# Altium schematic sheet Feedback.SchDoc
size 420 x 297 mm; DocumentNumber: 5; SheetNumber: 13; SheetTotal: 14; PageSetup: Record=PageOptions|CenterHorizontal=True|CenterVertical=True|PrintScale=0.96|XCorrection=1.00|YCorrection=1.00|PrintKind=1|BorderSize=5000000|LeftOffset=0|BottomOffset=0|Orientation=2|PaperLength=4318|PaperWidth=2794|Scale=100|PaperSource=7|PrintQuality=600|MediaType=1|DitherType=10|PaperKind=11" x 17"|PrintScaleMode=1
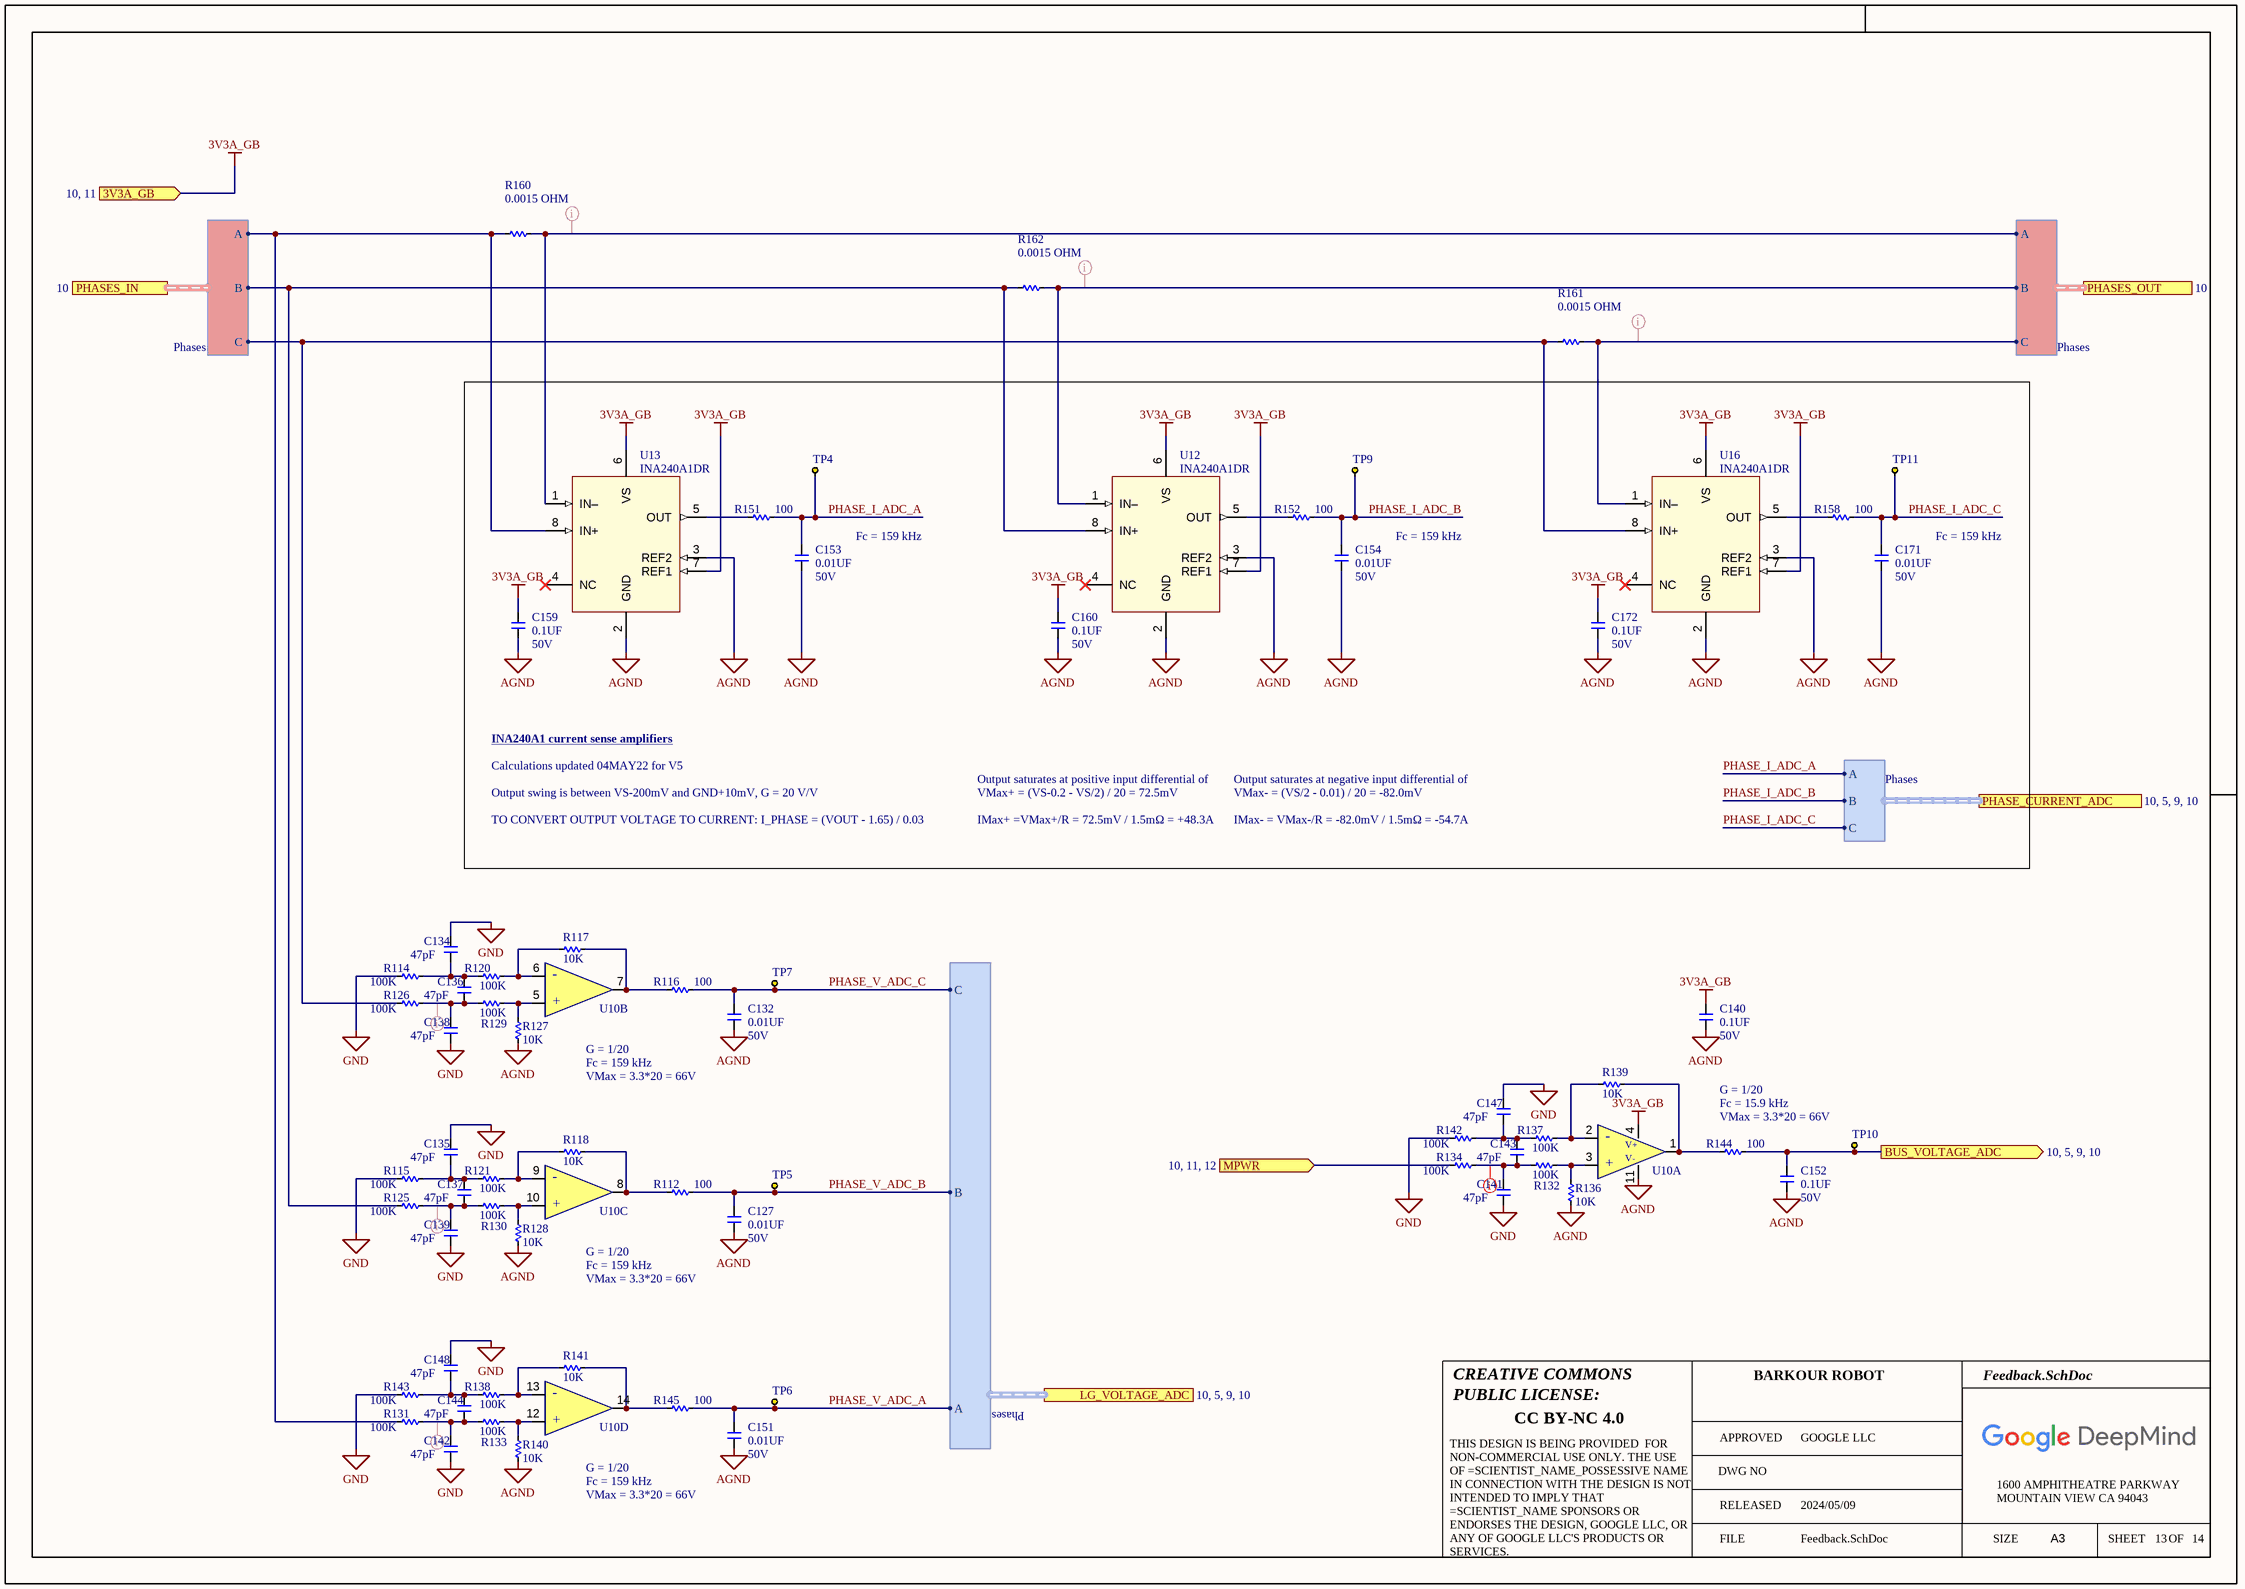
[diagram p0: Feedback.SchDoc]

## Parts
C127  value 0.01UF  Voltage: 50V  [C0402]  (hidden comment: __Template_Cap)
C132  value 0.01UF  Voltage: 50V  [C0402]  (hidden comment: __Template_Cap)
C134  value 47pF  [C0402]  (hidden comment: __Template_Cap)
C135  value 47pF  [C0402]  (hidden comment: __Template_Cap)
C136  value 47pF  [C0402]  (hidden comment: __Template_Cap)
C137  value 47pF  [C0402]  (hidden comment: __Template_Cap)
C138  value 47pF  [C0402]  (hidden comment: __Template_Cap)
C139  value 47pF  [C0402]  (hidden comment: __Template_Cap)
C140  value 0.1UF  Voltage: 50V  [C0402]  (hidden comment: __Template_Cap)
C141  value 47pF  [C0402]  (hidden comment: __Template_Cap)
C142  value 47pF  [C0402]  (hidden comment: __Template_Cap)
C143  value 47pF  [C0402]  (hidden comment: __Template_Cap)
C144  value 47pF  [C0402]  (hidden comment: __Template_Cap)
C147  value 47pF  [C0402]  (hidden comment: __Template_Cap)
C148  value 47pF  [C0402]  (hidden comment: __Template_Cap)
C151  value 0.01UF  Voltage: 50V  [C0402]  (hidden comment: __Template_Cap)
C152  value 0.1UF  Voltage: 50V  [C0402]  (hidden comment: __Template_Cap)
C153  value 0.01UF  Voltage: 50V  [C0402]  (hidden comment: __Template_Cap)
C154  value 0.01UF  Voltage: 50V  [C0402]  (hidden comment: __Template_Cap)
C159  value 0.1UF  Voltage: 50V  [C0402]  (hidden comment: __Template_Cap)
C160  value 0.1UF  Voltage: 50V  [C0402]  (hidden comment: __Template_Cap)
C171  value 0.01UF  Voltage: 50V  [C0402]  (hidden comment: __Template_Cap)
C172  value 0.1UF  Voltage: 50V  [C0402]  (hidden comment: __Template_Cap)
R112  100  [R0402]
R114  100K  [R0603]
R115  100K  [R0603]
R116  100  [R0402]
R117  10K  [R0402]
R118  10K  [R0402]
R120  100K  [R0603]
R121  100K  [R0603]
R125  100K  [R0603]
R126  100K  [R0603]
R127  10K  [R0402]
R128  10K  [R0402]
R129  100K  [R0603]
R130  100K  [R0603]
R131  100K  [R0603]
R132  100K  [R0603]
R133  100K  [R0603]
R134  100K  [R0603]
R136  10K  [R0402]
R137  100K  [R0603]
R138  100K  [R0603]
R139  10K  [R0402]
R140  10K  [R0402]
R141  10K  [R0402]
R142  100K  [R0603]
R143  100K  [R0603]
R144  100  [R0402]
R145  100  [R0402]
R151  100  [R0402]
R152  100  [R0402]
R158  100  [R0402]
R160  0.0015 OHM  [R2512]
R161  0.0015 OHM  [R2512]
R162  0.0015 OHM  [R2512]
TP4  TEST_KEYSTONE5015  [TP_KEYSTONE_5015]  (value not drawn)
TP5  TEST_KEYSTONE5015  [TP_KEYSTONE_5015]  (value not drawn)
TP6  TEST_KEYSTONE5015  [TP_KEYSTONE_5015]  (value not drawn)
TP7  TEST_KEYSTONE5015  [TP_KEYSTONE_5015]  (value not drawn)
TP9  TEST_KEYSTONE5015  [TP_KEYSTONE_5015]  (value not drawn)
TP10  TEST_KEYSTONE5015  [TP_KEYSTONE_5015]  (value not drawn)
TP11  TEST_KEYSTONE5015  [TP_KEYSTONE_5015]  (value not drawn)
U10  MCP6064  [14TSSOP65]  (value not drawn)  (parts A,B,C,D of 4)
U12  INA240A1DR  [TI SOIC-8 D0008A]
U13  INA240A1DR  [TI SOIC-8 D0008A]
U16  INA240A1DR  [TI SOIC-8 D0008A]

## Ports
3V3A_GB (in, see 10, 11), BUS_VOLTAGE_ADC (out, see 10, 5, 9, 10), LG_VOLTAGE_ADC (harness Phases, see 10, 5, 9, 10), MPWR (in, see 10, 11, 12), PHASE_CURRENT_ADC (harness Phases, see 10, 5, 9, 10), PHASES_IN (harness Phases, see 10), PHASES_OUT (harness Phases, see 10)

## Harnesses
Phases: A, B, C

## Nets
3V3A_GB: C140.1 C159.1 C160.1 C172.1 U10.4 U12.6(VS) U12.7(REF1) U13.6(VS) U13.7(REF1) U16.6(VS) U16.7(REF1) ; port 3V3A_GB
AGND: C127.2 C132.2 C140.2 C151.2 C152.2 C153.2 C154.2 C159.2 C160.2 C171.2 C172.2 R127.1 R128.1 R136.1 R140.1 U10.11 U12.2(GND) U12.3(REF2) U13.2(GND) U13.3(REF2) U16.2(GND) U16.3(REF2)
GND: C134.2 C135.2 C138.1 C139.1 C141.1 C142.1 C147.2 C148.2 R114.1 R115.1 R142.1 R143.1
BUS_VOLTAGE_ADC: C152.1 R144.2 TP10.1 ; port BUS_VOLTAGE_ADC
MPWR: R134.1 ; port MPWR
PHASE_I_ADC_A: C153.1 R151.2 TP4.1 ; port PHASE_CURRENT_ADC.A
PHASE_I_ADC_B: C154.1 R152.2 TP9.1 ; port PHASE_CURRENT_ADC.B
PHASE_I_ADC_C: C171.1 R158.2 TP11.1 ; port PHASE_CURRENT_ADC.C
PHASE_V_ADC_A: C151.1 R145.2 TP6.1 ; port LG_VOLTAGE_ADC.A
PHASE_V_ADC_B: C127.1 R112.2 TP5.1 ; port LG_VOLTAGE_ADC.B
PHASE_V_ADC_C: C132.1 R116.2 TP7.1 ; port LG_VOLTAGE_ADC.C
NetC134_1: C134.1 C136.2 R114.2 R120.1
NetC135_1: C135.1 C137.2 R115.2 R121.1
NetC136_1: C136.1 C138.2 R126.2 R129.1
NetC137_1: C137.1 C139.2 R125.2 R130.1
NetC141_2: C141.2 C143.1 R132.1 R134.2
NetC142_2: C142.2 C144.1 R131.2 R133.1
NetC143_2: C143.2 C147.1 R137.1 R142.2
NetC144_2: C144.2 C148.1 R138.1 R143.2
NetR112_1: R112.1 R118.1 U10.8
NetR116_1: R116.1 R117.1 U10.7
NetR117_2: R117.2 R120.2 U10.6
NetR118_2: R118.2 R121.2 U10.9
NetR125_1: R125.1 R162.1 U12.8(IN+) ; port PHASES_IN.B
NetR126_1: R126.1 R161.1 U16.8(IN+) ; port PHASES_IN.C
NetR127_2: R127.2 R129.2 U10.5
NetR128_2: R128.2 R130.2 U10.10
NetR131_1: R131.1 R160.1 U13.8(IN+) ; port PHASES_IN.A
NetR132_2: R132.2 R136.2 U10.3
NetR133_2: R133.2 R140.2 U10.12
NetR137_2: R137.2 R139.2 U10.2
NetR138_2: R138.2 R141.2 U10.13
NetR139_1: R139.1 R144.1 U10.1
NetR141_1: R141.1 R145.1 U10.14
NetR151_1: R151.1 U13.5(OUT)
NetR152_1: R152.1 U12.5(OUT)
NetR158_1: R158.1 U16.5(OUT)
NetR160_2: R160.2 U13.1(IN–) ; port PHASES_OUT.A
NetR161_2: R161.2 U16.1(IN–) ; port PHASES_OUT.C
NetR162_2: R162.2 U12.1(IN–) ; port PHASES_OUT.B

Not connected (* = marked no-connect by the designer): U12 4(NC)*; U13 4(NC)*; U16 4(NC)*

## Layout directives
net class HVSW: NetC136_1, NetC137_1, NetC142_2, NetR160_2, NetR161_2, NetR162_2
net class HV: NetC141_2

## Notes on the sheet
- Fc = 159 kHz
- Output swing is between VS-200mV and GND+10mV, G = 20 V/V
- INA240A1 current sense amplifiers <https://www.ti.com/lit/ds/symlink/ina240.pdf>
- Calculations updated 04MAY22 for V5
- VMax+ = (VS-0.2 - VS/2) / 20 = 72.5mV
- Output saturates at positive input differential of
- VMax- = (VS/2 - 0.01) / 20 = -82.0mV
- Output saturates at negative input differential of
- TO CONVERT OUTPUT VOLTAGE TO CURRENT: I_PHASE = (VOUT - 1.65) / 0.03
- IMax+ =VMax+/R = 72.5mV / 1.5mΩ = +48.3A
- IMax- = VMax-/R = -82.0mV / 1.5mΩ = -54.7A
- (near U10) G = 1/20
- VMax = 3.3*20 = 66V
- Fc = 15.9 kHz
- G = 1/20
- CREATIVE COMMONS
- PUBLIC LICENSE:
- BARKOUR ROBOT
- CC BY-NC 4.0
- APPROVED
- DWG NO
- GOOGLE LLC
- FILE
- RELEASED
- 2024/05/09
- SIZE
- 1600 AMPHITHEATRE PARKWAY
- MOUNTAIN VIEW CA 94043
- A3
- SHEET
- OF
- THIS DESIGN IS BEING PROVIDED  FOR NON-COMMERCIAL USE ONLY. THE USE OF =SCIENTIST_NAME_POSSESSIVE NAME IN CONNECTION WITH THE DESIGN IS NOT INTENDED TO IMPLY THAT =SCIENTIST_NAME SPONSORS OR ENDORSES THE DESIGN, GOOGLE LLC, OR ANY OF GOOGLE LLC'S PRODUCTS OR SERVICES.
- (in symbol MICROCHIP_MCP6064, part A) -; V+; V-; +
- (in symbol MICROCHIP_MCP6064, part B) -; +
- (in symbol MICROCHIP_MCP6064, part C) -; +
- (in symbol MICROCHIP_MCP6064, part D) -; +

## Library data of the parts
C127 C132 C151 C153 C154 C171 = 625: CAP, CER, X7R, 0.01uF, 50V, 20%, 0402, 0.56mm T; MFG: KEMET; MFG P/N: C0402C103M5RACTU; COMMON: 150-00227-00; Status: Released; Package: 0402; Supplier 1: Digi-Key; ComponentLink1URL: https://www.digikey.com/en/products/detail/kemet/C0402C103M5RAC7867/2196227; Supplier Part Number 1: 399-C0402C103M5RAC7867CT-ND
C134-C139 C141-C144 C147 C148 = 1447: CAP, CER, C0G, 47PF, 5%, 50V, 0402; MFG: TDK; MFG P/N: C1005C0G1H470J050BA; COMMON: 150-00181-00; Status: NRND; Package: 0402; Voltage: 50V; Supplier 1: Digi-Key; ComponentLink1URL: https://www.digikey.com/en/products/detail/tdk-corporation/C1005C0G1H470J050BA/513693; Supplier Part Number 1: 445-1243-1-ND
C140 C152 C159 C160 C172 = 1762: CAP, CER, X5R, 0.1uF, 10%, 50V, 0402, 0.55mm; MFG: YAGEO; MFG P/N: CC0402KRX5R9BB104; Status: Released; Package: 0402; Supplier 1: Digi-Key; ComponentLink1URL: http://www.yageo.com/documents/recent/UPY-GPHC_X5R_4V-to-50V_25.pdf; Supplier Part Number 1: 311-3342-1-ND
R112 R116 R144 R145 R151 R152 R158 = 7286: RES, 100, 1%, 1/10W, 0402, AUTO GRADE; MFG: PANASONIC; MFG P/N: ERJ2RKF1000X; COMMON: 470-00294-00; Status: Released; Package: 0402; Value: 100; Supplier 1: Digi-Key; ComponentLink1URL: https://www.digikey.com/en/products/detail/panasonic-electronic-components/ERJ-2RKF1000X/192080; Supplier Part Number 1: P100LCT-ND
R114 R115 R120 R121 R125 R126 R129-R134 R137 R138 R142 R143 = 6516: RES, 100K, 1%, 1/10W, 0603, AUTO GRADE; MFG: PANASONIC; MFG P/N: ERJ3EKF1003V; COMMON: 470-00120-00; Status: Released; Package: 0603; Value: 100K; Supplier 1: Digi-Key; ComponentLink1URL: https://www.digikey.com/en/products/detail/panasonic-electronic-components/ERJ-3EKF1003V/196075; Supplier Part Number 1: P100KHCT-ND
R117 R118 R127 R128 R136 R139-R141 = 7216: RES, 10K, 1%, 1/10W, 0402, AUTOGRADE; MFG: PANASONIC; MFG P/N: ERJ2RKF1002X; COMMON: 470-00319-00; Status: Released; Package: 0402; Value: 10K; Supplier 1: Digi-Key; ComponentLink1URL: https://www.digikey.com/en/products/detail/panasonic-electronic-components/ERJ-2RKF1002X/192073; Supplier Part Number 1: P10.0KLCT-ND
R160-R162 = 9999: RES, 0.0015, 1%, 3W, 2512; MFG: TE Connectivity Passive Product; MFG P/N: TLR3A30DR0015FTDG; Status: Released; Package: 2512; Value: 0.0015 OHM; Supplier 1: Digi-Key; ComponentLink1URL: https://www.te.com/commerce/DocumentDelivery/DDEController?Action=srchrtrv&DocNm=1773449-3&DocType=DS&DocLang=English; Supplier Part Number 1: A131795CT-ND
TP4-TP7 TP9-TP11 = TEST_KEYSTONE5015: PC TEST POINT MINIATURE SMT; MFG: Keystone Electronics; MFG P/N: 5015; Value: 5015; COMMON: 250-00207-00; Supplier 1: Digi-Key; ComponentLink1URL: http://mail.keyelco.com/ENG._DEPT/PDF%20CAT%20NO%20Drawings/5015.pdf; Supplier Part Number 1: 36-5015CT-ND; Status: In Development
U10 = MICROCHIP_MCP6064: Microchip MCP6064-E/ST; Quad Op Amp; 0.73MHz CMOS; Rail to Rail; 3V; 5V; 14-Pin TSSOP; MFG: Microchip Technology; ComponentLink1URL: http://www.microchip.com/mymicrochip/filehandler.aspx?ddocname=en528763; Supplier 1: Digi-Key; Supplier Part Number 1: MCP6064-E/ST-ND; MFG P/N: MCP6064-E/ST; Value: MCP6064-E/ST
U12 U13 U16 = INA240A1: Current Sense Amplifiers -4 to 80V, bidirectional, ultra-precise current sense amplifier with enhanced PWM rejection, 20V/V gain; MFG: Texas Instruments; Supplier 1: Digi-Key; Supplier Part Number 1: 296-51172-1-ND; ComponentLink1URL: https://www.digikey.com/en/products/detail/texas-instruments/INA240A1DR/8538109; MFG P/N: INA240A1DR; Value: INA240A1DR